# Altium schematic sheet ElectroPlantoE.SchDoc
size A
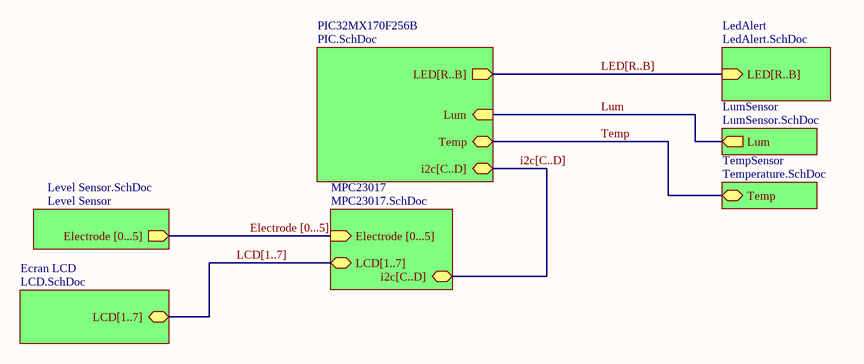
[diagram p0: ElectroPlantoE.SchDoc]

## Sub-sheets
Ecran LCD = LCD.SchDoc: LCD[1..7] (bidir)
LedAlert = LedAlert.SchDoc: LED[R..B] (in)
Level Sensor = Level Sensor.SchDoc: Electrode [0...5] (out)
LumSensor = LumSensor.SchDoc: Lum (out)
MPC23017 = MPC23017.SchDoc: i2c[C..D] (bidir), Electrode [0...5] (in), LCD[1..7] (bidir)
PIC32MX170F256B = PIC.SchDoc: LED[R..B] (out), Lum (in), Temp, i2c[C..D] (bidir)
TempSensor = Temperature.SchDoc: Temp (bidir)

## Nets
Lum: sheet PIC32MX170F256B/Lum, sheet LumSensor/Lum
Temp: sheet PIC32MX170F256B/Temp, sheet TempSensor/Temp

## Buses and harness runs
bus Electrode [0...5] = sheet Level Sensor/Electrode [0...5] = sheet MPC23017/Electrode [0...5]
bus i2c[C..D] = sheet MPC23017/i2c[C..D] = sheet PIC32MX170F256B/i2c[C..D]
bus LCD[1..7] = sheet Ecran LCD/LCD[1..7] = sheet MPC23017/LCD[1..7]
bus LED[R..B] = sheet LedAlert/LED[R..B] = sheet PIC32MX170F256B/LED[R..B]